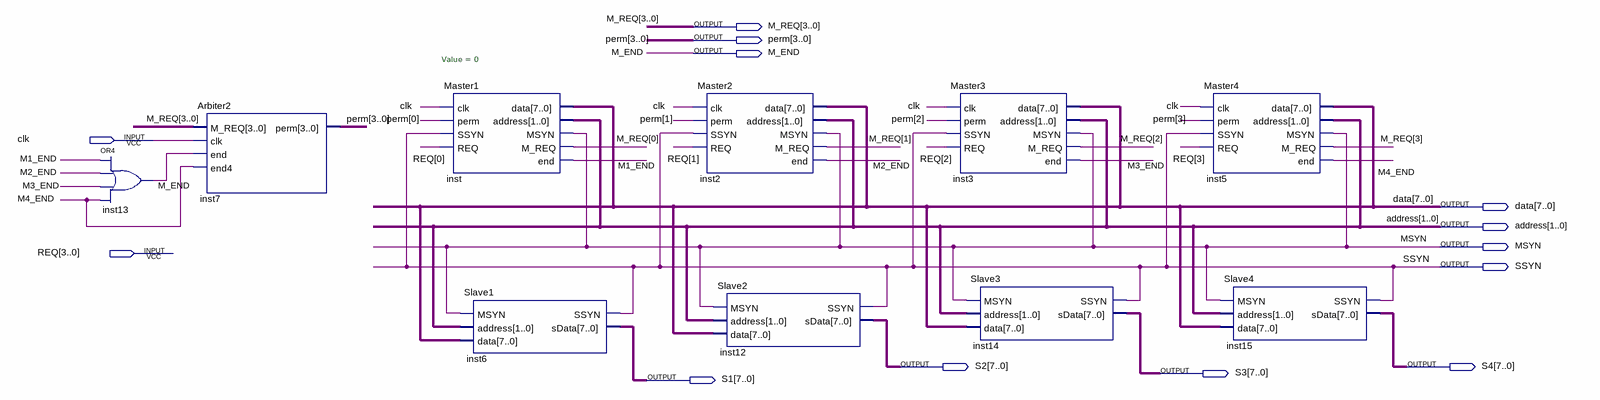
[diagram p0: schematic sheet]
// Quartus schematic Main.bdf as structural Verilog: 10 symbols, 13 pins
module Main (
  input  clk,
  input  [3:0] REQ,
  output [3:0] M_REQ,
  output [3:0] perm,
  output M_END,
  output [7:0] data,
  output [1:0] address,
  output MSYN,
  output SSYN,
  output [7:0] S2,
  output [7:0] S4,
  output [7:0] S3,
  output [7:0] S1
);

  wire M1_END, M2_END, M3_END, M4_END;

  or inst13 (M_END, M1_END, M2_END, M3_END, M4_END);
  Arbiter2 inst7 (.M_REQ(M_REQ), .clk(clk), .\end (M_END), .end4(M4_END), .perm(perm));
  Master1 #(.Value(0)) inst (
    .clk(clk), .perm(perm[0]), .SSYN(SSYN), .REQ(REQ[0]), .data(data), .address(address), .MSYN(MSYN),
    .M_REQ(M_REQ[0]), .\end (M1_END));
  Slave1 inst6 (.MSYN(MSYN), .address(address), .data(data), .SSYN(SSYN), .sData(S1));
  Master2 inst2 (
    .clk(clk), .perm(perm[1]), .SSYN(SSYN), .REQ(REQ[1]), .data(data), .address(address), .MSYN(MSYN),
    .M_REQ(M_REQ[1]), .\end (M2_END));
  Slave2 inst12 (.MSYN(MSYN), .address(address), .data(data), .SSYN(SSYN), .sData(S2));
  Master3 inst3 (
    .clk(clk), .perm(perm[2]), .SSYN(SSYN), .REQ(REQ[2]), .data(data), .address(address), .MSYN(MSYN),
    .M_REQ(M_REQ[2]), .\end (M3_END));
  Slave3 inst14 (.MSYN(MSYN), .address(address), .data(data), .SSYN(SSYN), .sData(S3));
  Master4 inst5 (
    .clk(clk), .perm(perm[3]), .SSYN(SSYN), .REQ(REQ[3]), .data(data), .address(address), .MSYN(MSYN),
    .M_REQ(M_REQ[3]), .\end (M4_END));
  Slave4 inst15 (.MSYN(MSYN), .address(address), .data(data), .SSYN(SSYN), .sData(S4));
endmodule
